# EAGLE schematic aaaabbbbbccccc (EAGLE 9.0.1)
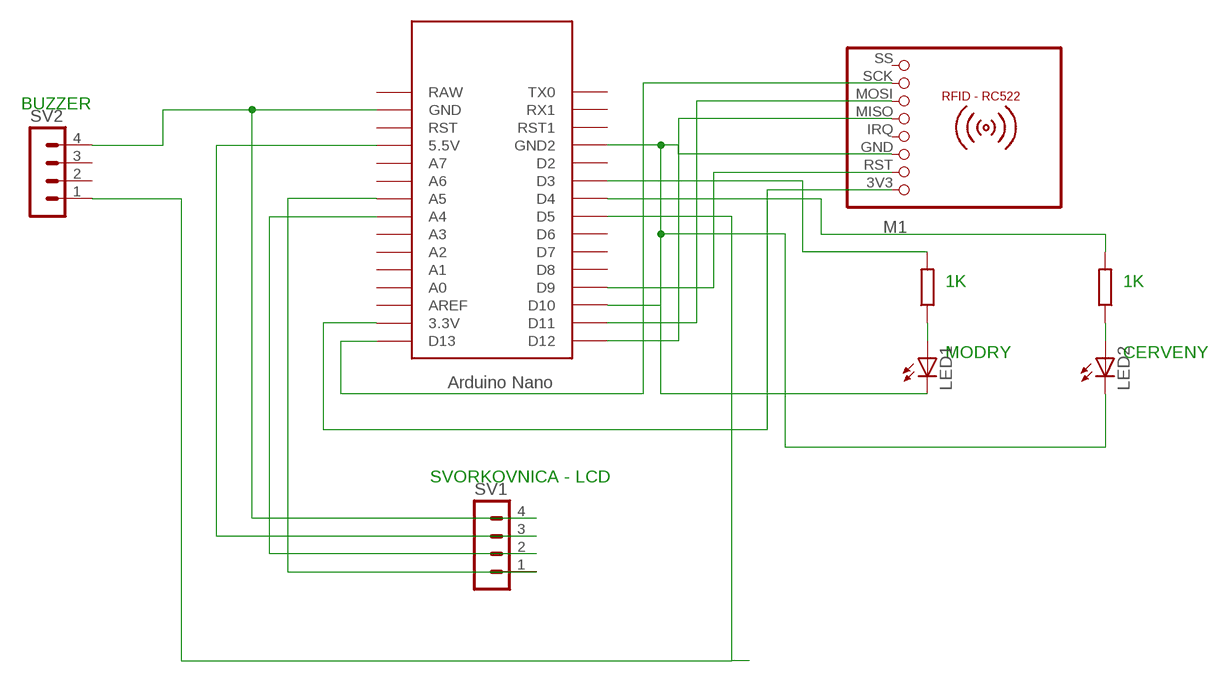
[diagram p0: schematic, sheet 1]

## Parts
LED1  LED3MM  [LED3MM]
LED2  LED3MM  [LED3MM]
M1  RFID-RC522  [RFID-RC522]
SV1  MA04-1  [MA04-1]
SV2  MA04-1  [MA04-1]
U$1  NANO  [NANO]

## Nets
N$1: M1.3V3 U$1.3.3V
N$2: LED1.K(C) LED2.K(C) M1.GND U$1.GND1(GND2)
N$3: M1.RST U$1.D9
N$4: M1.MISO U$1.D12
N$5: M1.MOSI U$1.D11
N$6: M1.SCK U$1.D13
N$7: U$1.D10
N$8: SV1.4 SV2.4 U$1.GND
N$9: SV1.3 U$1.5V(5.5V)
N$10: SV1.2 U$1.A4
N$11: SV1.1 U$1.A5
N$13: LED1.A
N$14: LED2.A
N$15: U$1.D3
N$16: U$1.D4
N$18: SV2.1 U$1.D5
Unconnected: M1.IRQ M1.SS SV2.2 SV2.3 U$1.A0 U$1.A1 U$1.A2 U$1.A3 U$1.A6 U$1.A7 U$1.AREF U$1.D2 U$1.D6 U$1.D7 U$1.D8 U$1.ICSP1 U$1.ICSP2 U$1.ICSP3 U$1.ICSP4 U$1.ICSP5 U$1.ICSP6 U$1.RAW U$1.RST U$1.RST1 U$1.RX1 U$1.TX0

## Notes on the sheet
- BUZZER
- 1K | 1K
- MODRY | CERVENY
- SVORKOVNICA - LCD

## Library data of the parts
LED1 LED2 = adafruit:LED: LED OSRAM: - CHIPLED LG R971, LG N971, LY N971, LG Q971, LY Q971, LO R971, LY R971 LH N974, LH R974 LS Q976, LO Q976, LY Q976 LO Q996 - Hyper CHIPLED LW Q18S LB Q993, LB Q99A, LB R99A - SideLED LS A670, LO A670, LY A670, LG A670, LP A670 LB A673, LV A673, LT A673, LW A673 LH A674 LY A675 LS A676, LA A676, LO A676, LY A676, LW A676 LS A679, LY A679, LG A679 - Hyper Micro SIDELED® LS Y876, LA Y876, LO Y876, LY Y876 LT Y87S - SmartLED LW L88C, LW L88S LB L89C, LB L89S, LG L890 LS L89K, LO L89K, LY L89K LS L896, LA L896, LO L896, LY L896 - TOPLED LS T670, LO T670, LY T670, LG T670, LP T670 LSG T670, LSP T670, LSY T670, LOP T670, LYG T670 LG T671, LOG T671, LSG T671 LB T673, LV T673, LT T673, LW T673 LH T674 LS T676, LA T676, LO T676, LY T676, LB T676, LH T676, LSB T676, LW T676 LB T67C, LV T67C, LT T67C, LS T67K, LO T67K, LY T67K, LW E67C LS E67B, LA E67B, LO E67B, LY E67B, LB E67C, LV E67C, LT E67C LW T67C LS T679, LY T679, LG T679 LS T770, LO T770, LY T770, LG T770, LP T770 LB T773, LV T773, LT T773, LW T773 LH T774 LS E675, LA E675, LY E675, LS T675 LS T776, LA T776, LO T776, LY T776, LB T776 LHGB T686 LT T68C, LB T68C - Hyper Mini TOPLED® LB M676 - Mini TOPLED Santana® LG M470 LS M47K, LO M47K, LY M47K Source: http://www.osram.convergy.de/
M1 = mfrc522-module:RFID-RC522: RFID-RC522 MFRC-522 based breakout board
SV1 SV2 = con-lstb:MA04-1: PIN HEADER; OC_FARNELL: unknown; OC_NEWARK: unknown
U$1 = Arduino-clone:NANO: Arduino Nano